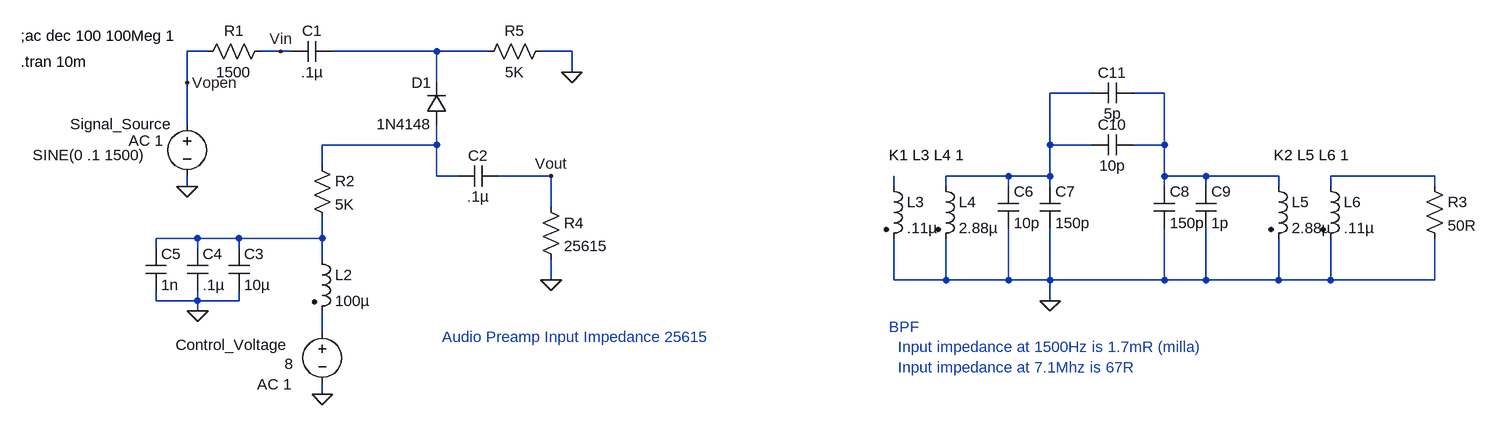
[diagram p0: schematic Diode Audio Switch Testing.asc]
Diode Audio Switch Testing.asc, the LTspice schematic file:
Version 4
SHEET 1 2548 680
WIRE -160 16 -192 16
WIRE -48 16 -80 16
WIRE -32 16 -48 16
WIRE 192 16 32 16
WIRE 272 16 192 16
WIRE 400 16 352 16
WIRE 400 48 400 16
WIRE -192 64 -192 16
WIRE 192 64 192 16
WIRE 1200 80 1136 80
WIRE 1312 80 1264 80
WIRE -192 128 -192 64
WIRE 192 160 192 128
WIRE 192 160 16 160
WIRE 1136 160 1136 80
WIRE 1200 160 1136 160
WIRE 1312 160 1312 80
WIRE 1312 160 1264 160
WIRE 16 192 16 160
WIRE 192 208 192 160
WIRE 224 208 192 208
WIRE 368 208 288 208
WIRE 1072 208 976 208
WIRE 1136 208 1136 160
WIRE 1136 208 1072 208
WIRE 1312 208 1312 160
WIRE 1376 208 1312 208
WIRE 1488 208 1376 208
WIRE 1728 208 1568 208
WIRE -192 224 -192 208
WIRE 896 224 896 208
WIRE 976 224 976 208
WIRE 1072 224 1072 208
WIRE 1136 224 1136 208
WIRE 1312 224 1312 208
WIRE 1376 224 1376 208
WIRE 1488 224 1488 208
WIRE 1568 224 1568 208
WIRE 1728 224 1728 208
WIRE 368 256 368 208
WIRE -176 304 -240 304
WIRE -112 304 -176 304
WIRE 16 304 16 272
WIRE 16 304 -112 304
WIRE -240 320 -240 304
WIRE -176 320 -176 304
WIRE -112 320 -112 304
WIRE 16 336 16 304
WIRE 368 368 368 336
WIRE 896 368 896 304
WIRE 976 368 976 304
WIRE 976 368 896 368
WIRE 1072 368 1072 288
WIRE 1072 368 976 368
WIRE 1136 368 1136 288
WIRE 1136 368 1072 368
WIRE 1312 368 1312 288
WIRE 1312 368 1136 368
WIRE 1376 368 1376 288
WIRE 1376 368 1312 368
WIRE 1488 368 1488 304
WIRE 1488 368 1376 368
WIRE 1568 368 1568 304
WIRE 1568 368 1488 368
WIRE 1728 368 1728 304
WIRE 1728 368 1568 368
WIRE -240 400 -240 384
WIRE -176 400 -176 384
WIRE -176 400 -240 400
WIRE -112 400 -112 384
WIRE -112 400 -176 400
WIRE 1136 400 1136 368
WIRE -176 416 -176 400
WIRE 16 448 16 416
WIRE 16 544 16 528
FLAG 16 544 0
FLAG -192 224 0
FLAG 368 368 0
FLAG 368 208 Vout
FLAG 400 48 0
FLAG -176 416 0
FLAG -192 64 Vopen
FLAG -48 16 Vin
FLAG 1136 400 0
SYMBOL res -64 0 R90
WINDOW 0 0 56 VBottom 2
WINDOW 3 32 56 VTop 2
SYMATTR InstName R1
SYMATTR Value 1500
SYMBOL cap 32 0 R90
WINDOW 0 0 32 VBottom 2
WINDOW 3 32 32 VTop 2
SYMATTR InstName C1
SYMATTR Value .1µ
SYMBOL voltage 16 432 R0
WINDOW 123 -100 97 Left 2
WINDOW 39 0 0 Left 2
WINDOW 0 -226 36 Left 2
WINDOW 3 -58 65 Left 2
SYMATTR Value2 AC 1
SYMATTR InstName Control_Voltage
SYMATTR Value 8
SYMBOL voltage -192 112 R0
WINDOW 3 -238 64 Left 2
WINDOW 123 -90 41 Left 2
WINDOW 39 0 0 Left 2
WINDOW 0 -180 16 Left 2
SYMATTR Value SINE(0 .1 1500)
SYMATTR Value2 AC 1
SYMATTR InstName Signal_Source
SYMBOL res 352 240 R0
SYMATTR InstName R4
SYMATTR Value 25615
SYMBOL cap 288 192 R90
WINDOW 0 0 32 VBottom 2
WINDOW 3 32 32 VTop 2
SYMATTR InstName C2
SYMATTR Value .1µ
SYMBOL diode 208 128 R180
WINDOW 0 24 64 Left 2
WINDOW 3 24 0 Left 2
SYMATTR InstName D1
SYMATTR Value 1N4148
SYMBOL ind2 0 320 R0
SYMATTR InstName L2
SYMATTR Value 100µ
SYMATTR Type ind
SYMBOL res 0 176 R0
SYMATTR InstName R2
SYMATTR Value 5K
SYMBOL cap -128 320 R0
SYMATTR InstName C3
SYMATTR Value 10µ
SYMBOL cap -192 320 R0
SYMATTR InstName C4
SYMATTR Value .1µ
SYMBOL cap -256 320 R0
SYMATTR InstName C5
SYMATTR Value 1n
SYMBOL cap 1056 224 R0
SYMATTR InstName C6
SYMATTR Value 10p
SYMBOL cap 1120 224 R0
SYMATTR InstName C7
SYMATTR Value 150p
SYMBOL cap 1296 224 R0
SYMATTR InstName C8
SYMATTR Value 150p
SYMBOL cap 1360 224 R0
SYMATTR InstName C9
SYMATTR Value 1p
SYMBOL cap 1264 144 R90
WINDOW 0 0 32 VBottom 2
WINDOW 3 32 32 VTop 2
SYMATTR InstName C10
SYMATTR Value 10p
SYMBOL cap 1264 64 R90
WINDOW 0 0 32 VBottom 2
WINDOW 3 32 32 VTop 2
SYMATTR InstName C11
SYMATTR Value 5p
SYMBOL ind2 880 208 R0
SYMATTR InstName L3
SYMATTR Value .11µ
SYMATTR Type ind
SYMBOL ind2 960 208 R0
SYMATTR InstName L4
SYMATTR Value 2.88µ
SYMATTR Type ind
SYMBOL ind2 1472 208 R0
SYMATTR InstName L5
SYMATTR Value 2.88µ
SYMATTR Type ind
SYMBOL ind2 1552 208 R0
SYMATTR InstName L6
SYMATTR Value .11µ
SYMATTR Type ind
SYMBOL res 1712 208 R0
SYMATTR InstName R3
SYMATTR Value 50R
SYMBOL res 368 0 R90
WINDOW 0 0 56 VBottom 2
WINDOW 3 32 56 VTop 2
SYMATTR InstName R5
SYMATTR Value 5K
TEXT 200 456 Left 2 ;Audio Preamp Input Impedance 25615
TEXT -448 32 Left 2 !.tran 10m
TEXT -448 -8 Left 2 !;ac dec 100 100Meg 1
TEXT 888 176 Left 2 !K1 L3 L4 1
TEXT 1480 176 Left 2 !K2 L5 L6 1
TEXT 888 440 Left 2 ;BPF\n  Input impedance at 1500Hz is 1.7mR (milla)\n  Input impedance at 7.1Mhz is 67R

The netlist it stands for:
* Diode Audio Switch Testing.asc
R1 Vin Vopen 1500
C1 N001 Vin .1µ
V§Control_Voltage N008 0 8 AC 1
V§Signal_Source Vopen 0 SINE(0 .1 1500) AC 1
R4 Vout 0 25615
C2 Vout N004 .1µ
D1 N004 N001 1N4148
L2 N007 N008 100µ
R2 N004 N007 5K
C3 N007 0 10µ
C4 N007 0 .1µ
C5 N007 0 1n
C6 N002 0 10p
C7 N002 0 150p
C8 N003 0 150p
C9 N003 0 1p
C10 N003 N002 10p
C11 N003 N002 5p
L3 N006 0 .11µ
L4 N002 0 2.88µ
L5 N003 0 2.88µ
L6 N005 0 .11µ
R3 N005 0 50R
R5 0 N001 5K
.model D D
.lib standard.dio
* Audio Preamp Input Impedance 25615
.tran 10m
;ac dec 100 100Meg 1
K1 L3 L4 1
K2 L5 L6 1
* BPF
*   Input impedance at 1500Hz is 1.7mR (milla)
*   Input impedance at 7.1Mhz is 67R
.backanno
.end